# EAGLE design ACESBinaryGame2019V3 (EAGLE 9.4.2)
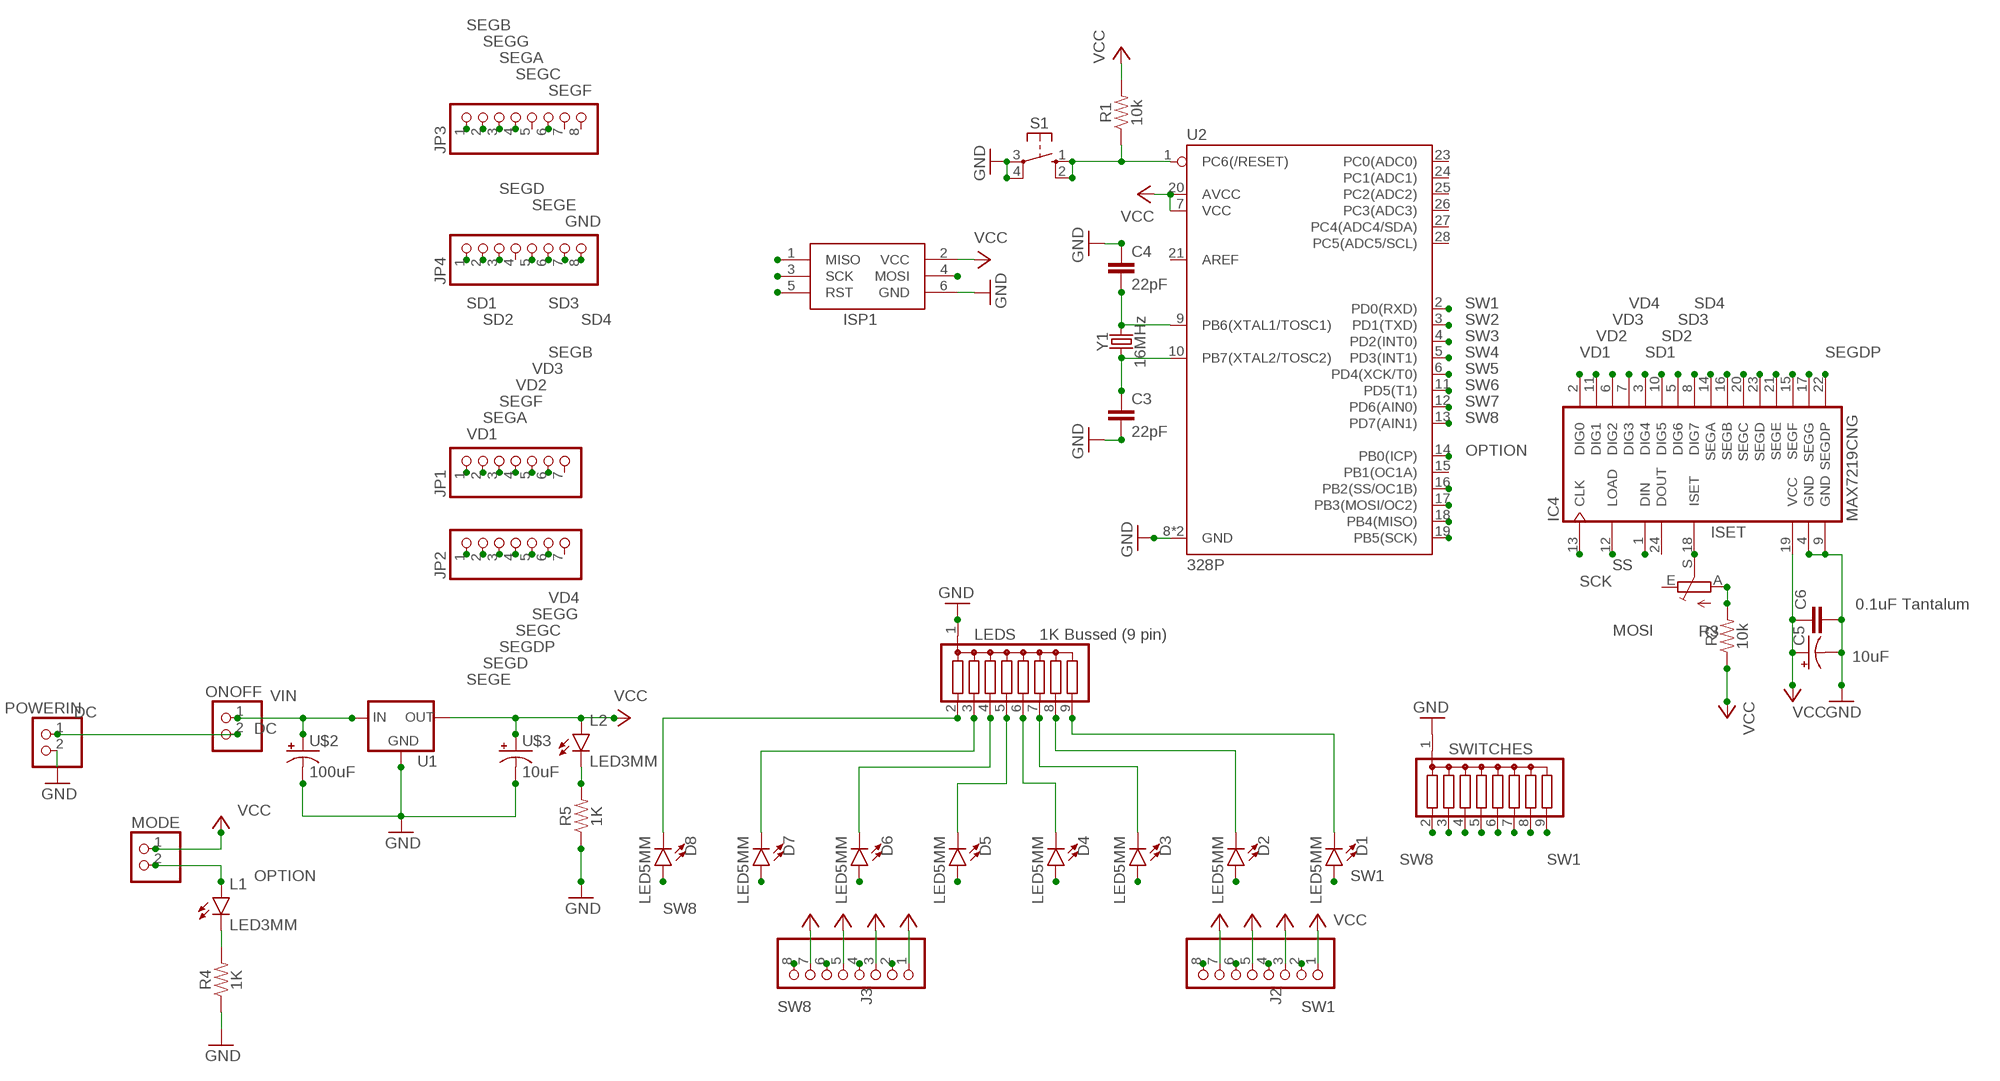
[diagram p0: schematic, sheet 1]

## Parts
C3  22pF  22PF-PTH-2.54MM-200V-5%  [CAP-PTH-2.54]
C4  22pF  22PF-PTH-2.54MM-200V-5%  [CAP-PTH-2.54]
C5  10uF  CAPACITOR_POLARIZED  [CPOL-RADIAL-2.5MM-5MM]
C6  0.1uF Tantalum  CAPACITOR_DISK  [CAP-PTH-2.54]
D1  LED5MM  [LED5MM]
D2  LED5MM  [LED5MM]
D3  LED5MM  [LED5MM]
D4  LED5MM  [LED5MM]
D5  LED5MM  [LED5MM]
D6  LED5MM  [LED5MM]
D7  LED5MM  [LED5MM]
D8  LED5MM  [LED5MM]
IC4  MAX7219CNG  [DIL24-3]
ISP1  AVRISP-6  [AVRISP]
J2  PINHD-1X8-3.5MM  [1X08-3.5MM]
J3  PINHD-1X8-3.5MM  [1X08-3.5MM]
JP1  PINHD-1X7  [1X07]
JP2  PINHD-1X7  [1X07]
JP3  PINHD-1X8  [1X08]
JP4  PINHD-1X8  [1X08]
L1  LED3MM  [LED3MM]
L2  LED3MM  [LED3MM]
LEDS  1K Bussed (9 pin)  G08R  [SIL9]
MODE  PINHD-1X2  [1X02]
ONOFF  PINHD-1X2  [1X02]
POWERIN  PINHD-1X2  [1X02]
R1  10k  10KOHM-HORIZ-1/6W-5%  [AXIAL-0.3]
R2  10k  10KOHM-HORIZ-1/6W-5%  [AXIAL-0.3]
R3  TRIM_EU-B25P  [B25P]
R4  1K  10KOHM-HORIZ-1/6W-5%  [AXIAL-0.3]
R5  1K  10KOHM-HORIZ-1/6W-5%  [AXIAL-0.3]
S1  MOMENTARY_BUTTONS  [B3F-40XX]
SWITCHES  G08R  [SIL9]
U1  LM78XX  [78XXL]
U2  328P  ATMEGA328P_PDIP  [DIP28]
U$2  100uF  CAPACITOR_POLARIZED  [CPOL-RADIAL-2.5MM-5MM]
U$3  10uF  CAPACITOR_POLARIZED  [CPOL-RADIAL-2.5MM-5MM]
Y1  16MHz  CRYSTAL-16MHZPTH-HC49US  [HC49US]

## Nets
DC: ONOFF.2 POWERIN.1
GND: C3.2 C4.1 C5.2(-) C6.2 IC4.4(GND) IC4.9(GND) ISP1.6(GND) JP4.7 LEDS.1 POWERIN.2 R4.P$1 R5.P$1 S1.3(P) S1.4(P1) SWITCHES.1 U1.GND U2.8(GND) U2.22(GND) U$2.2(-) U$3.2(-)
ISET: IC4.18(ISET) R3.S
MISO: ISP1.1(MISO) U2.18(PB4(MISO))
MOSI: IC4.1(DIN) ISP1.4(MOSI) U2.17(PB3(MOSI/OC2))
N$1: L1.K(C) R4.P$2
N$2: C3.1 U2.10(PB7(XTAL2/TOSC2)) Y1.1
N$3: C4.2 U2.9(PB6(XTAL1/TOSC1)) Y1.2
N$4: R2.P$2 R3.A
N$5: L2.K(C) R5.P$2
N$12: D1.K(C) LEDS.9
N$23: D2.K(C) LEDS.8
N$24: D3.K(C) LEDS.7
N$25: D4.K(C) LEDS.6
N$26: D5.K(C) LEDS.5
N$27: D6.K(C) LEDS.4
N$28: D7.K(C) LEDS.3
N$29: D8.K(C) LEDS.2
OPTION: L1.A MODE.2 U2.14(PB0(ICP))
RST: ISP1.5(RST) R1.P$1 S1.1(S) S1.2(S1) U2.1(PC6(/RESET))
SCK: IC4.13(CLK) ISP1.3(SCK) U2.19(PB5(SCK))
SD1: IC4.3(DIG4) JP4.1
SD2: IC4.10(DIG5) JP4.2
SD3: IC4.5(DIG6) JP4.6
SD4: IC4.8(DIG7) JP4.8
SEGA: IC4.14(SEGA) JP1.2 JP3.3
SEGB: IC4.16(SEGB) JP1.6 JP3.1
SEGC: IC4.20(SEGC) JP2.4 JP3.4
SEGD: IC4.23(SEGD) JP2.2 JP4.3
SEGDP: IC4.22(SEGDP) JP2.3
SEGE: IC4.21(SEGE) JP2.1 JP4.5
SEGF: IC4.15(SEGF) JP1.3 JP3.6
SEGG: IC4.17(SEGG) JP2.5 JP3.2
SS: IC4.12(LOAD) U2.16(PB2(SS/OC1B))
SW1: D1.A J2.2 SWITCHES.9 U2.2(PD0(RXD))
SW2: D2.A J2.4 SWITCHES.8 U2.3(PD1(TXD))
SW3: D3.A J2.6 SWITCHES.7 U2.4(PD2(INT0))
SW4: D4.A J2.8 SWITCHES.6 U2.5(PD3(INT1))
SW5: D5.A J3.2 SWITCHES.5 U2.6(PD4(XCK/T0))
SW6: D6.A J3.4 SWITCHES.4 U2.11(PD5(T1))
SW7: D7.A J3.6 SWITCHES.3 U2.12(PD6(AIN0))
SW8: D8.A J3.8 SWITCHES.2 U2.13(PD7(AIN1))
VCC: C5.1(+) C6.1 IC4.19(VCC) ISP1.2(VCC) J2.1 J2.3 J2.5 J2.7 J3.1 J3.3 J3.5 J3.7 L2.A MODE.1 R1.P$2 R2.P$1 U1.OUT U2.7(VCC) U2.20(AVCC) U$3.1(+)
VD1: IC4.2(DIG0) JP1.1
VD2: IC4.11(DIG1) JP1.4
VD3: IC4.6(DIG2) JP1.5
VD4: IC4.7(DIG3) JP2.6
VIN: ONOFF.1 U1.IN U$2.1(+)
Unconnected: IC4.24(DOUT) JP1.7 JP2.7 JP3.5 JP3.7 JP3.8 JP4.4 R3.E U2.15(PB1(OC1A)) U2.21(AREF) U2.23(PC0(ADC0)) U2.24(PC1(ADC1)) U2.25(PC2(ADC2)) U2.26(PC3(ADC3)) U2.27(PC4(ADC4/SDA)) U2.28(PC5(ADC5/SCL))

## Library data of the parts
C3 C4 = SparkFun-Capacitors:22PF: 22pF ceramic capacitors A capacitor is a passive two-terminal electrical component used to store electrical energy temporarily in an electric field.; PROD_ID: CAP-09128
C5 U$2 U$3 = ACES_THT:CAPACITOR_POLARIZED
C6 = ACES_THT:CAPACITOR_DISK: Use for 0.1μF (103) and 0.01μF (104). Also suitable for 22ρF crystal filter caps for offboard ATmega328p.
D1-D8 L1 L2 = ACES_THT:LED
IC4 = max7219:MAX7219CNG: LED DISPLAY DRIVER; MF: MAXIM; MPN: MAX7219CNG; OC_FARNELL: 1523914; OC_NEWARK: 34C4018
ISP1 = adafruit:AVRISP: AVR ISP HEADER Standard 6 pin header for AVR programming
J2 J3 = adafruit:PINHD-1X8: PIN HEADER
JP1 JP2 = pinhead:PINHD-1X7: PIN HEADER
JP3 JP4 = pinhead:PINHD-1X8: PIN HEADER
LEDS SWITCHES = resistor-sil:G08R: SIL RESISTOR; OC_FARNELL: unknown; OC_NEWARK: unknown
MODE ONOFF POWERIN = pinhead:PINHD-1X2: PIN HEADER
R1 R2 = SparkFun-Resistors:10KOHM: 10kΩ resistor A resistor is a passive two-terminal electrical component that implements electrical resistance as a circuit element. Resistors act to reduce current flow, and, at the same time, act to lower voltage levels within circuits. - Wikipedia; PROD_ID: RES-08375
R3 = pot:TRIM_EU-: POTENTIOMETER
R4 R5 = SparkFun-Resistors:10KOHM: 10kΩ resistor A resistor is a passive two-terminal electrical component that implements electrical resistance as a circuit element. Resistors act to reduce current flow, and, at the same time, act to lower voltage levels within circuits. - Wikipedia; PROD_ID: RES-08375; VALUE: 10k
S1 = ACES_THT:MOMENTARY_BUTTONS: OMRON SWITCH; MF: OMRON COMPONENTS USA; MPN: B3F-4000; OC_FARNELL: 176434; OC_NEWARK: 36K3105
U1 = ACES_THT:LM78XX: 1+ A Positive Voltage Regulators 5V Example: LM7805 <https://media.digikey.com/pdf/Data%20Sheets/ON%20Semiconductor%20PDFs/MC7800(A,AE),NCV7800.pdf>
U2 = SparkFun-IC-Microcontroller:ATMEGA328P_PDIP: Atmel 328P Through hole ATMEGA328P uC used in the Arduino 32kb flash, 1k EEPROM, 2k SRAM Datasheet <http://www.sparkfun.com/datasheets/Components/SMD/ATMega328.pdf> SparkFun Products Storefront component: AVR 28 Pin 20MHz 32K 6A/D - ATMega328P <https://www.sparkfun.com/products/9061> (COM-09061) SparkFun Simon Says - Through-Hole Soldering Kit <https://www.sparkfun.com/products/10547> (KIT-10547) SparkFun Learn to Solder - Simon Says <https://www.sparkfun.com/products/13708> (KIT-13708) SparkFun BigTime Watch Kit <https://www.sparkfun.com/products/11734> (KIT-11734) SparkFun ClockIt <https://www.sparkfun.com/products/10930> (KIT-10930) SparkFun Serial Enabled LCD Kit <https://www.sparkfun.com/products/10097> (LCD-10097) SparkFun Simon Tilts - Through Hole Soldering Kit <https://www.sparkfun.com/products/12634> (KIT-12634) SparkFun Frequency Counter Kit <https://www.sparkfun.com/products/10140> (KIT-10140) FabFM Radio Kit <https://www.sparkfun.com/products/11043> (KIT-11043) SparkFun Binary Blaster Kit <https://www.sparkfun.com/products/12037> (KIT-12037) SparkFun Metro-Gnome <https://www.sparkfun.com/products/9236> (KIT-09236) ATmega328 with Arduino Optiboot (Uno) <https://www.sparkfun.com/products/10524> (DEV-10524); PROD_ID: IC-09136
Y1 = SparkFun-Clocks:CRYSTAL-16MHZ: 16MHz Crystal Digikey Example <http://www.digikey.com/product-search/en?keywords=535-9122-1-ND> Frequency: 16MHz Frequency Stability: ±50ppm Frequency Tolerance: ±20ppm Load Capacitance: 18pF SparkFun Products: Pro Micro -5V/16MHz <https://www.sparkfun.com/products/12640> SparkFun Serial Enabled LCD Kit <https://www.sparkfun.com/products/10097>; PROD_ID: XTAL-08181; SF_ID: COM-00536

## Board
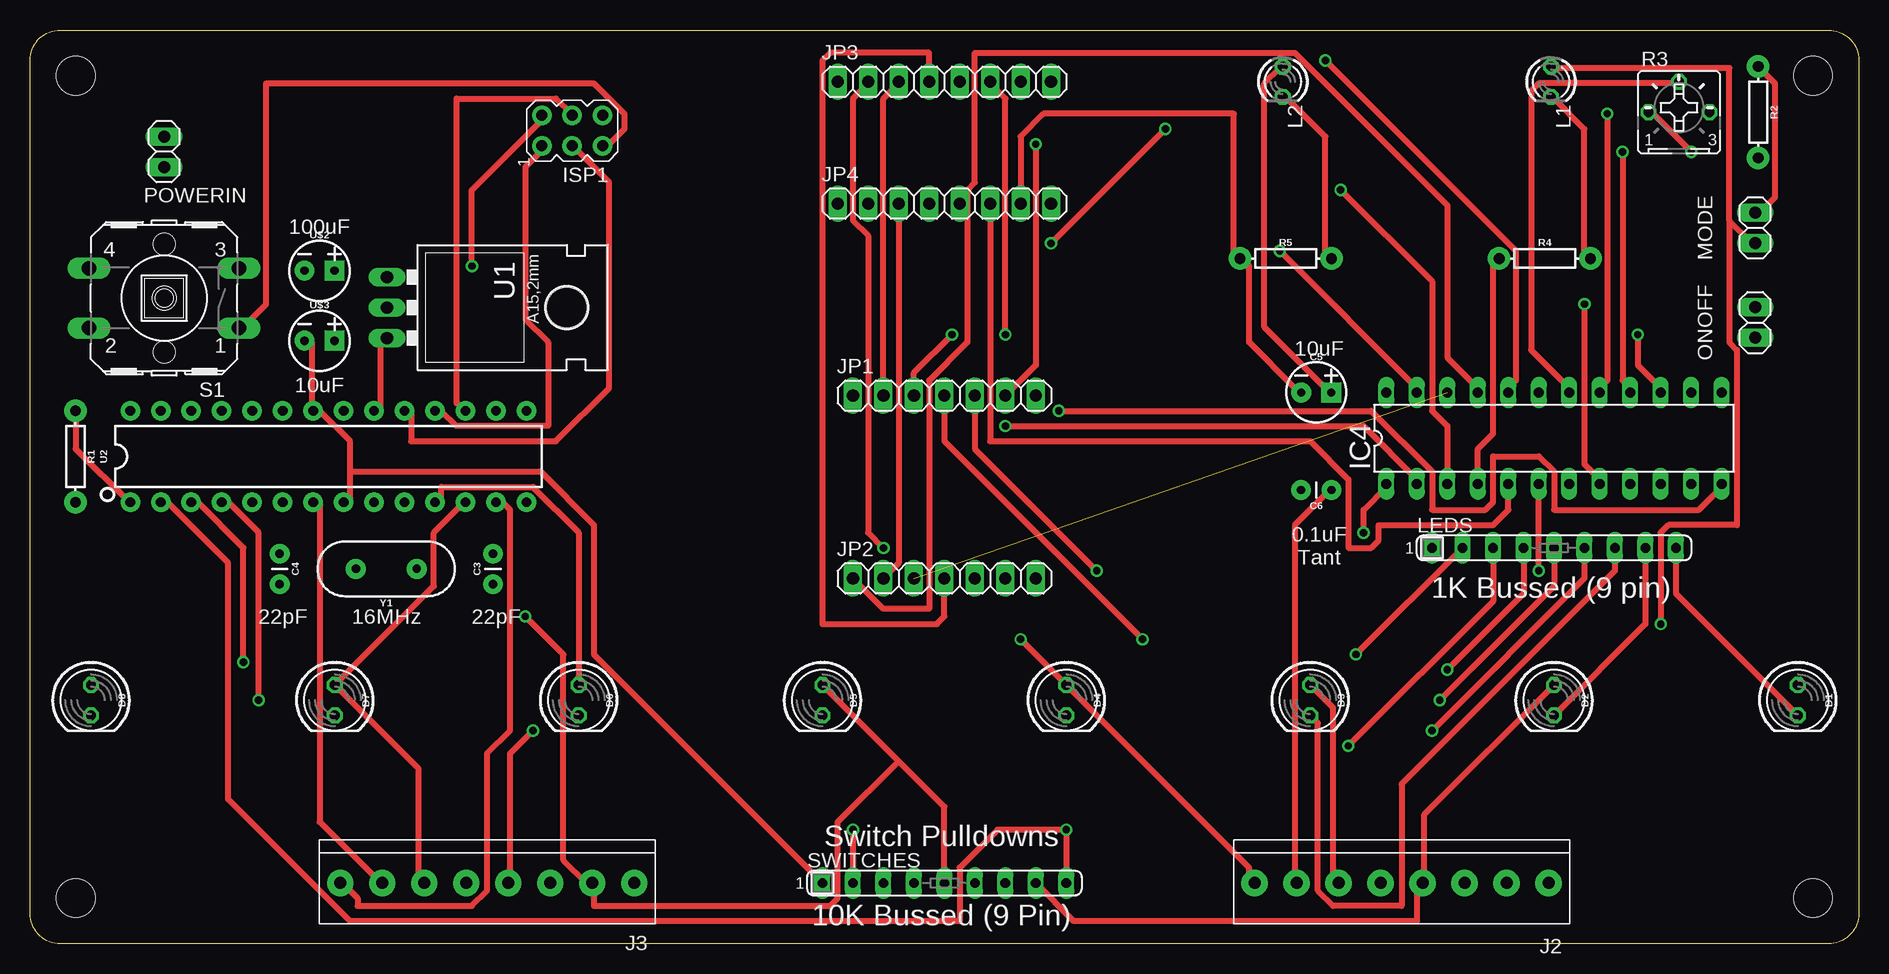
[diagram p1: board, top side]
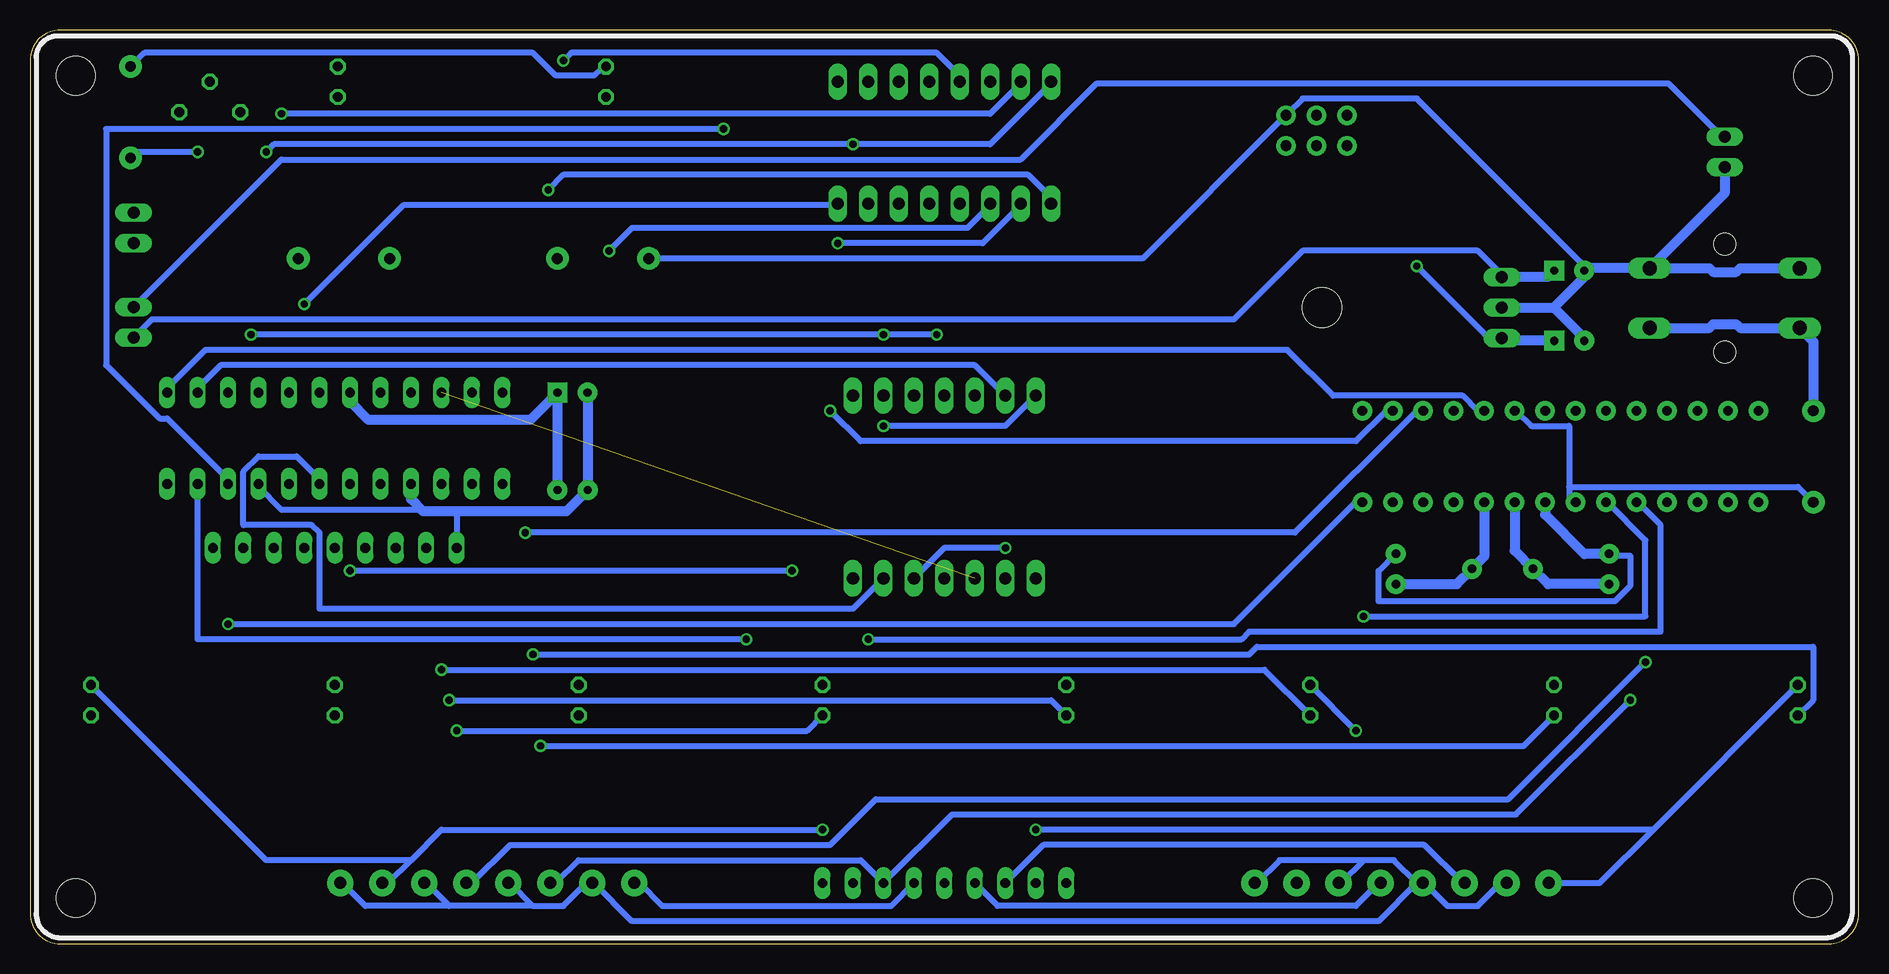
[diagram p2: board, bottom side, seen from below]

Size 152.4 x 76.2 mm. Coordinates in mm from the lower left corner, seen from the top.
Outline: 2.54,76.2 149.86,76.2 arc-90 152.4,73.66 152.4,2.54 arc-90 149.86,0 2.54,0 arc-90 0,2.54 0,73.66 arc-90 2.54,76.2
Copper layers (1*16): Top 0.035mm / dielectric 1.5mm / Bottom 0.035mm
Design rules "default *": minimum track width 20mil, minimum drill 24mil, track to track 24mil, track to pad 8mil, pad to pad 8mil, via to via 8mil, smd to smd 8mil, copper to edge 40mil, drill to drill 8mil, minimum pad ring 10mil, minimum via ring 8mil, stop-mask expansion 4mil, vias tented up to drill 0mil, thermal gap 10mil
Holes 3.2 mm at 3.81,3.81 3.81,72.39 148.59,72.39 148.59,3.81

### Footprints (pad centres in the part's own frame; a part is rotated, then mirrored left to right if it is on the bottom)
CAP-PTH-2.54 = drill 0.7 pad 1.651: 1 -1.27,0; 2 1.27,0
CPOL-RADIAL-2.5MM-5MM = drill 0.7 pad 1.651 square: 1 1.25,0 | drill 0.7 pad 1.651: 2 -1.25,0
LED5MM = drill 0.813 octagon: A -1.27,0; K 1.27,0
DIL24-3 = drill 0.813 long: 1 -13.97,-3.81; 2 -11.43,-3.81; 3 -8.89,-3.81; 4 -6.35,-3.81; 5 -3.81,-3.81; 6 -1.27,-3.81; 7 1.27,-3.81; 8 3.81,-3.81; 9 6.35,-3.81; 10 8.89,-3.81; 11 11.43,-3.81; 12 13.97,-3.81; 13 13.97,3.81; 14 11.43,3.81; 15 8.89,3.81; 16 6.35,3.81; 17 3.81,3.81; 18 1.27,3.81; 19 -1.27,3.81; 20 -3.81,3.81; 21 -6.35,3.81; 22 -8.89,3.81; 23 -11.43,3.81; 24 -13.97,3.81
AVRISP = drill 0.9 pad 1.626: 1 -1.27,2.54; 2 1.27,2.54; 3 -1.27,0; 4 1.27,0; 5 -1.27,-2.54; 6 1.27,-2.54
1X08-3.5MM = drill 1 pad 2.184: 1 -12.25,0; 2 -8.75,0; 3 -5.25,0; 4 -1.75,0; 5 1.75,0; 6 5.25,0; 7 8.75,0; 8 12.25,0
1X07 = drill 1.016 long: 1 -7.62,0; 2 -5.08,0; 3 -2.54,0; 4 0,0; 5 2.54,0; 6 5.08,0; 7 7.62,0
1X08 = drill 1.016 long: 1 -8.89,0; 2 -6.35,0; 3 -3.81,0; 4 -1.27,0; 5 1.27,0; 6 3.81,0; 7 6.35,0; 8 8.89,0
LED3MM = drill 0.813 octagon: A -1.27,0; K 1.27,0
SIL9 = drill 0.813 long: 1 -10.16,0; 2 -7.62,0; 3 -5.08,0; 4 -2.54,0; 5 0,0; 6 2.54,0; 7 5.08,0; 8 7.62,0; 9 10.16,0
1X02 = drill 1.016 long: 1 -1.27,0; 2 1.27,0
AXIAL-0.3 = drill 0.9 pad 1.88: P$1 -3.81,0; P$2 3.81,0
B25P = drill 0.813 octagon: A -2.54,0; E 2.54,0; S 0,2.54
B3F-40XX = drill 1.194 long: 1 -6.248,2.489; 2 6.248,2.489; 3 -6.248,-2.489; 4 6.248,-2.489 | hole 1.803: 0,-4.496; 0,4.496
78XXL = drill 1.016 long: GND 0,-3.81; IN -2.54,-3.81; OUT 2.54,-3.81 | hole 3.302: 0,11.176
DIP28 = drill 0.813 pad 1.626: 1 -16.51,-3.81; 2 -13.97,-3.81; 3 -11.43,-3.81; 4 -8.89,-3.81; 5 -6.35,-3.81; 6 -3.81,-3.81; 7 -1.27,-3.81; 8 1.27,-3.81; 9 3.81,-3.81; 10 6.35,-3.81; 11 8.89,-3.81; 12 11.43,-3.81; 13 13.97,-3.81; 14 16.51,-3.81; 15 16.51,3.81; 16 13.97,3.81; 17 11.43,3.81; 18 8.89,3.81; 19 6.35,3.81; 20 3.81,3.81; 21 1.27,3.81; 22 -1.27,3.81; 23 -3.81,3.81; 24 -6.35,3.81; 25 -8.89,3.81; 26 -11.43,3.81; 27 -13.97,3.81; 28 -16.51,3.81
HC49US = drill 0.7 pad 1.651: 1 -2.54,0; 2 2.54,0

### Placement (x,y rotation side)
C3  38.58,31.27 90 top
C4  20.8,31.27 270 top
C5  107.19,45.97 0 top
C6  107.19,37.85 180 top
D1  147.32,20.32 270 top
D2  127,20.32 270 top
D3  106.68,20.32 270 top
D4  86.36,20.32 270 top
D5  66.04,20.32 270 top
D6  45.72,20.32 270 top
D7  25.4,20.32 270 top
D8  5.08,20.32 270 top
IC4  127,42.16 0 top
ISP1  45.19,67.82 90 top
J2  114.3,5.08 180 top
J3  38.1,5.08 180 top
JP1  76.2,45.72 0 top
JP2  76.2,30.48 0 top
JP3  76.2,71.88 0 top
JP4  76.2,61.72 0 top
L1  126.75,71.88 270 top
L2  104.39,71.88 270 top
LEDS  127,33.02 0 top
MODE  143.76,59.69 270 top
ONOFF  143.76,51.82 90 top
POWERIN  11.18,66.04 270 top
R1  3.78,40.64 270 top
R2  144.02,69.34 270 top
R3  137.41,69.34 0 top
R4  126.24,57.15 0 top
R5  104.65,57.15 0 top
S1  11.18,53.85 180 top
SWITCHES  76.2,5.08 0 top
U1  33.55,53.06 270 top
U2  24.87,40.64 0 top
U$1  [ACES_LOGO_MEDIUM]  28.19,68.83 0 top
U$2  24.13,56.13 0 top
U$3  24.13,50.29 0 top
Y1  29.69,31.27 180 top

### Tracks (layer width: path | path; a pad name or v marks a point on that pad's centre or on a via)
DC
  Bottom 0.508: ONOFF.2 131.44,65.41 69.85,65.41 63.5,71.75 15.88,71.75 11.43,67.31 POWERIN.1
GND
  Top 0.508: JP4.7 82.55,67.31 84.45,69.22 100.33,69.22 100.33,57.15 R5.P$1 100.97,57.15 101.6,56.52 101.6,50.16 105.41,46.35 C5.2 | IC4.4 120.65,41.27 121.92,42.55 121.92,57.15 R4.P$1 | U$3.2 23.5,50.16 23.5,44.45 U2.22 24.13,44.45 26.67,41.91 26.67,39.37 | SWITCHES.1 46.99,24.13 46.99,34.92 42.55,39.37 26.67,39.37 | 26.67,39.37 26.67,36.83 U2.8
  Bottom 0.508: LEDS.1 116.84,36.07 116.84,36.2 | IC4.9 133.35,38.1 131.44,36.2 120.02,36.2 119.63,36.07 | U$2.2 22.86,56.52 36.83,70.48 46.35,70.48 47.62,69.22 ISP1.6 48.26,68.58 59.69,57.15 R5.P$1 | C3.2 40.01,31.11 40.01,28.57 20.32,28.57 19.05,29.84 19.05,32.38 20.32,32.38 C4.1
  Bottom 0.813: C5.2 105.94,37.87 C6.2 107.7,36.07 116.84,36.07 119.63,36.07 120.65,37.08 IC4.4 | 29.72,53.09 U1.GND 25.43,53.06 | S1.3 22.68,56.34 U$2.2 22.88,55.61 25.43,53.06 | S1.3 12.46,56.34 12.14,56.02 10.21,56.02 9.9,56.34 S1.4 | POWERIN.2 11.18,62.59 S1.3 | U2.8 26.14,35.79 22.86,32.51 22.84,32.54 C4.1 | 25.43,53.06 22.88,50.52 U$3.2
ISET
  Top 0.508: IC4.18 128.27,46.35 125.09,49.53 125.09,71.12 125.73,71.75 137.16,71.75 R3.S
MISO
  Top 0.508: U2.18 34.29,44.45 35.56,43.18 43.18,43.18 43.18,50.16 41.27,52.07 41.27,64.77 42.55,66.04 ISP1.1
MOSI  (via drill 0.61)
  Top 0.508: v111.12,34.29 111.12,36.2 113.03,38.1 IC4.1 | ISP1.4 45.09,69.22 43.81,70.48 35.56,70.48 35.56,45.09 36.2,44.45 U2.17
  Bottom 0.508: v111.12,34.29 46.99,34.29 36.83,44.45 U2.17
N$1
  Top 0.508: L1.K 127,70.48 129.54,67.94 129.54,57.15 R4.P$2
N$2
  Bottom 0.813: U2.10 31.22,32.28 Y1.1 33.5,30 C3.1
N$3
  Bottom 0.813: U2.9 28.68,32.79 Y1.2 25.88,30 C4.2
N$4  (via drill 0.61)
  Top 0.508: v138.43,66.04 135.25,69.22 R3.A
  Bottom 0.508: v138.43,66.04 143.51,66.04 R2.P$2
N$5
  Top 0.508: L2.K 104.78,70.48 107.95,67.31 107.95,57.15 R5.P$2
N$12
  Top 0.508: D1.K 137.16,29.21 LEDS.9
N$23
  Top 0.508: D2.K 134.62,26.67 LEDS.8
N$24
  Top 0.508: D3.K 107.31,18.41 107.31,4.45 108.58,3.17 114.3,3.17 114.3,13.34 132.08,31.11 LEDS.7
N$25  (via drill 0.61)
  Top 0.508: v116.84,17.78 129.54,30.48 LEDS.6
  Bottom 0.508: D4.K 87.63,17.78 v116.84,17.78
N$26  (via drill 0.61)
  Top 0.508: v117.47,20.32 127,29.84 LEDS.5
  Bottom 0.508: D5.K 67.31,20.32 v117.47,20.32
N$27  (via drill 0.61)
  Top 0.508: v118.11,22.86 124.46,29.21 LEDS.4
  Bottom 0.508: D6.K 49.53,22.86 v118.11,22.86
N$28  (via drill 0.61)
  Top 0.508: v109.86,16.51 121.92,28.57 LEDS.3
  Bottom 0.508: D7.K 27.94,16.51 v109.86,16.51
N$29  (via drill 0.61)
  Top 0.508: LEDS.2 v110.49,24.13
  Bottom 0.508: D8.K 3.81,20.32 3.81,24.77 50.16,24.77 50.8,24.13 v110.49,24.13
OPTION  (via drill 0.61)
  Top 0.508: 141.6,60.33 141.6,73.03 127,73.03 L1.A | 141.6,60.33 143.51,58.42 MODE.2 | v135.89,26.67 135.89,34.29 136.53,34.92 142.24,34.92 142.24,49.53 141.6,50.16 141.6,60.33
  Bottom 0.508: v135.89,26.67 52.07,26.67 41.91,36.83 U2.14
RST
  Top 0.508: U2.1 8.26,36.83 3.81,41.27 3.81,44.45 R1.P$1 | ISP1.5 48.26,66.67 49.53,67.94 49.53,69.22 46.99,71.75 19.68,71.75 19.68,53.34 17.78,51.44 S1.1
  Bottom 0.813: S1.1 12.46,51.36 12.14,51.68 10.21,51.68 9.9,51.36 S1.2 3.79,50.22 R1.P$1
SCK
  Top 0.508: ISP1.3 45.72,66.04 48.26,63.5 48.26,46.35 43.81,41.91 31.75,41.91 31.75,44.45 U2.19
  Bottom 0.508: IC4.13 140.97,46.35 137.79,49.53 47.62,49.53 43.81,45.72 33.02,45.72 31.75,44.45 U2.19
SD1  (via drill 0.61)
  Top 0.508: IC4.3 118.11,43.18 116.84,44.45 116.84,55.24 v109.22,62.87
  Bottom 0.508: v109.22,62.87 107.95,64.14 69.22,64.14 67.31,62.23 JP4.1
SD2  (via drill 0.61)
  Top 0.508: v85.09,58.42 v94.61,67.94
  Bottom 0.508: v94.61,67.94 146.05,67.94 146.05,48.26 141.6,43.81 140.97,43.81 135.89,38.73 IC4.10 | v85.09,58.42 73.03,58.42 69.85,61.59 JP4.2
SD3
  Top 0.508: IC4.5 123.19,36.2 121.92,34.92 112.39,34.92 112.39,33.66 111.76,33.02 109.86,33.02 109.86,38.73 106.68,41.91 80.01,41.91 JP4.6
SD4  (via drill 0.61)
  Top 0.508: v129.54,53.34 129.54,40.01 130.81,38.73 IC4.8
  Bottom 0.508: v129.54,53.34 121.28,61.59 85.09,61.59 JP4.8
SEGA
  Top 0.508: JP1.2 71.12,70.48 72.39,71.75 JP3.3
  Bottom 0.508: JP1.2 73.66,48.26 136.53,48.26 138.43,46.35 IC4.14
SEGB  (via drill 0.61)
  Top 0.508: v132.72,66.04 132.72,46.99 133.35,46.35 IC4.16 | JP1.6 83.82,48.26 v83.82,66.67
  Bottom 0.508: v132.72,66.04 132.08,66.67 v83.82,66.67 72.39,66.67 67.31,71.75 JP3.1
SEGC  (via drill 0.61)
  Top 0.508: v107.95,73.66 123.83,57.78 123.83,46.99 123.19,46.35 IC4.20 | JP2.4 76.2,27.3 75.56,26.67 66.04,26.67 66.04,73.66 66.67,74.3 74.93,74.3 JP3.4
  Bottom 0.508: v107.95,73.66 107.31,74.3 76.83,74.3 74.93,72.39 JP3.4
SEGD  (via drill 0.61)
  Top 0.508: v104.14,57.78 115.57,46.35 IC4.23 | JP2.2 72.39,31.75 JP4.3
  Bottom 0.508: v104.14,57.78 102.23,59.69 74.3,59.69 72.39,61.59 JP4.3
SEGDP  (1 unrouted)
SEGE
  Top 0.508: 78.11,62.87 77.47,62.23 JP4.5 78.11,62.87 | 78.11,62.87 78.74,63.5 78.74,74.3 105.41,74.3 118.11,61.59 118.11,48.9 120.65,46.35 IC4.21 | JP2.1 71.12,27.94 74.93,27.94 74.93,46.99 78.11,50.16 78.11,62.87
SEGF  (via drill 0.61)
  Top 0.508: v133.99,50.8 133.99,48.26 135.89,46.35 IC4.15 | v76.83,50.8 73.66,47.62 JP1.3 | v81.28,50.8 81.28,70.48 80.01,71.75 JP3.6
  Bottom 0.508: v76.83,50.8 v81.28,50.8 v133.99,50.8
SEGG  (via drill 0.61)
  Top 0.508: v131.44,69.22 131.44,46.99 130.81,46.35 IC4.17 | v71.12,33.02 69.85,34.29 69.85,59.05 68.58,60.33 68.58,70.48 69.85,71.75 JP3.2
  Bottom 0.508: v131.44,69.22 72.39,69.22 69.85,71.75 JP3.2 | JP2.5 76.2,33.02 v71.12,33.02
SS  (via drill 0.61)
  Top 0.508: v85.72,44.45 111.76,44.45 116.84,39.37 116.84,36.2 121.28,36.2 121.92,36.83 121.92,40.64 125.73,40.64 127,39.37 127,36.2 139.06,36.2 140.97,38.1 IC4.12
  Bottom 0.508: v85.72,44.45 83.19,41.91 41.91,41.91 39.37,44.45 U2.16
SW1  (via drill 0.61)
  Top 0.508: SWITCHES.9 v86.36,9.53 80.64,9.53 77.47,6.35 77.47,1.91 26.67,1.91 16.51,12.06 16.51,31.75 11.43,36.83 U2.2
  Bottom 0.508: v86.36,9.53 118.11,9.53 120.65,6.99 | 120.65,6.99 122.56,5.08 J2.2 | D1.A 132.72,6.99 120.65,6.99
SW2  (via drill 0.61)
  Top 0.508: SWITCHES.8 87,1.91 115.57,1.91 115.57,5.08 J2.4 116.2,5.08 116.2,10.79 D2.A | v17.78,23.5 17.78,33.02 13.97,36.83 U2.3
  Bottom 0.508: v17.78,23.5 29.21,12.06 81.92,12.06 85.72,8.26 112.39,8.26 115.57,5.08 J2.4
SW3  (via drill 0.61)
  Top 0.508: D3.A 108.58,19.68 108.58,5.08 J2.6 | v19.05,20.32 19.05,34.29 16.51,36.83 U2.4
  Bottom 0.508: J2.6 108.58,5.08 106.68,6.99 83.19,6.99 SWITCHES.7 75.56,10.79 28.57,10.79 v19.05,20.32
SW4  (via drill 0.61)
  Top 0.508: J2.8 101.6,5.08 101.6,6.35 D4.A v82.55,25.4
  Bottom 0.508: SWITCHES.6 80.64,3.17 99.69,3.17 101.6,5.08 J2.8 | v82.55,25.4 51.44,25.4 50.8,26.04 16.51,26.04 16.51,34.92 18.41,36.83 U2.5
SW5  (via drill 0.61)
  Top 0.508: 72.39,15.24 76.2,11.43 SWITCHES.5 | 72.39,15.24 D5.A | v41.27,27.3 44.45,24.13 44.45,6.99 46.35,5.08 J3.2 46.99,5.08 46.99,3.17 66.67,3.17 67.31,3.81 67.31,10.16 72.39,15.24
  Bottom 0.508: v41.27,27.3 17.78,27.3 17.78,33.66 20.95,36.83 U2.6
SW6  (via drill 0.61)
  Top 0.508: D6.A 45.72,34.29 41.91,38.1 34.29,38.1 34.29,36.83 U2.11 | v41.91,17.78 40.01,15.88 40.01,5.08 J3.4
  Bottom 0.508: SWITCHES.4 71.75,3.17 41.91,3.17 40.01,5.08 J3.4 | v41.91,17.78 D6.A
SW7
  Top 0.508: J3.6 32.38,5.08 32.38,14.61 D7.A 33.66,29.84 33.66,34.29 36.2,36.83 U2.12
  Bottom 0.508: SWITCHES.3 67.94,8.26 36.2,8.26 33.02,5.08 J3.6
SW8  (via drill 0.61)
  Top 0.508: v68.58,9.53 SWITCHES.2 | U2.13 39.37,36.83 40.01,36.2 40.01,17.78 38.1,15.88 38.1,4.45 36.83,3.17 27.3,3.17 27.3,3.81 26.04,5.08 J3.8
  Bottom 0.508: 17.14,9.53 21.59,5.08 J3.8 | 17.14,9.53 D8.A | 17.14,9.53 v68.58,9.53
VCC  (via drill 0.61)
  Top 0.508: R2.P$1 145.41,71.75 145.41,62.23 144.15,60.96 MODE.1 | L2.A 104.14,73.03 102.87,71.75 102.87,51.44 107.95,46.35 C5.1 | J2.7 105.41,5.08 105.41,34.92 107.95,37.47 C6.1 | v36.83,56.52 36.83,62.87 42.55,68.58 ISP1.2 | J3.7 29.21,5.08 24.13,10.16 24.13,36.83 U2.7 | U1.OUT 29.21,50.16 29.21,44.45 U2.20
  Bottom 0.508: 110.49,3.17 107.95,3.17 106.05,5.08 J2.7 105.41,5.08 102.23,1.91 40.01,1.91 36.83,5.08 | 110.49,3.17 112.39,5.08 J2.5 | 117.47,3.17 119.38,5.08 J2.3 | 110.49,3.17 117.47,3.17 | 117.47,3.17 124.46,3.17 126.36,5.08 J2.1 | R2.P$1 142.88,74.3 110.49,74.3 108.58,72.39 105.41,72.39 104.78,73.03 L2.A | v36.83,56.52 31.11,50.8 29.84,50.8 U1.OUT | J3.7 29.84,5.08 31.75,3.17 34.29,3.17 36.2,5.08 J3.5 36.83,5.08 | 41.27,6.99 43.18,5.08 J3.3 | 41.27,6.99 38.73,6.99 36.83,5.08 | 41.27,6.99 48.26,6.99 50.16,5.08 J3.1 | 24.13,38.1 24.13,43.18 27.3,43.18 28.57,44.45 U2.20 | 24.13,38.1 24.13,36.83 U2.7 | 24.13,38.1 5.08,38.1 3.81,36.83 R1.P$2
  Bottom 0.813: C6.1 108.46,45.95 C5.1 110.72,43.69 124.21,43.69 125.73,45.21 IC4.19 | U$3.1 29.52,50.29 U1.OUT
VD1  (via drill 0.61)
  Top 0.508: v81.28,43.18 111.12,43.18 115.57,38.73 IC4.2
  Bottom 0.508: v81.28,43.18 71.12,43.18 JP1.1
VD2  (via drill 0.61)
  Top 0.508: v92.71,25.4 76.2,41.91 JP1.4
  Bottom 0.508: IC4.11 138.43,25.4 v92.71,25.4
VD3  (via drill 0.61)
  Top 0.508: v125.73,31.11 IC4.6 | v88.9,31.11 78.74,41.27 JP1.5
  Bottom 0.508: v88.9,31.11 v125.73,31.11
VD4
  Bottom 0.508: JP2.6 83.82,27.94 128.27,27.94 128.27,34.29 128.91,34.92 134.62,34.92 134.62,39.37 133.35,40.64 130.18,40.64 128.27,38.73 IC4.7
VIN
  Bottom 0.508: ONOFF.1 142.24,52.07 52.07,52.07 46.35,57.78 31.75,57.78 29.84,55.88 U1.IN
  Bottom 0.813: U$2.1 25.91,55.6 U1.IN

### Text on the board
_tsilk: 100uF | 10uF | 10uF | 0.1uF / Tant | 1K Bussed (9 pin) | 22pF | 16MHz | 22pF | Switch Pulldowns | 10K Bussed (9 Pin)
200bmp: ISP | C. D'ARCY | 10k | 9V | SCORE / 160-1547-5-ND/TDCG1060M-ND | Power | GND | -2020 | 2019 | ISet | K. FISET-ALGARVIO | Mode | 1K | 1K | 7805 | Binary Challenge v3 | I/O | ATMEGA328P | MAX7219CNG | 10k | VALUE / ADA-812 / ADA-1001 | 128 | 64 | 32 | 16 | 8 | 4 | 2 | 1